# EAGLE design PikaCharge V2 (EAGLE 9.3.1)
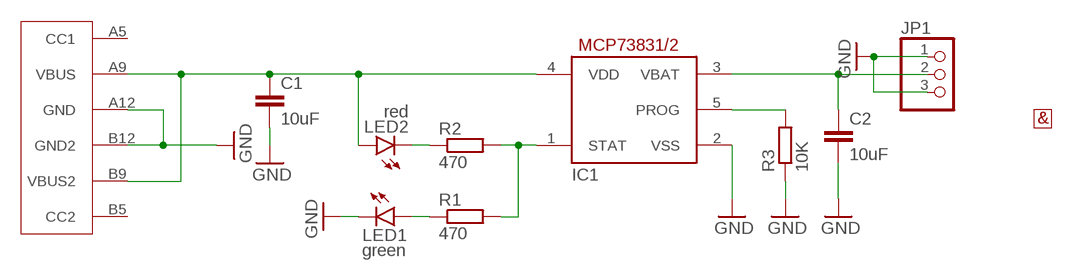
[diagram p0: schematic, sheet 1]

## Parts
C1  10uF  C-EUC0805  [C0805]
C2  10uF  C-EUC0805  [C0805]
IC1  MCP73831/OT  [SOT23-5L]
JP1  PINHD-1X03_2.54-S  [1X03-S]
LED1  green  LEDCHIP-LED0805  [CHIP-LED0805]
LED2  red  LEDCHIP-LED0805  [CHIP-LED0805]
R1  470  R-EU_R0805  [R0805]
R2  470  R-EU_R0805  [R0805]
R3  10K  R-EU_R0805  [R0805]
U$1  USB-C-6PIN  [USB-C-6PIN]
U$2  AMP-HALF  [AMP-HALF]

## Nets
GND: C1.2 C2.2 IC1.2(VSS) JP1.1 JP1.3 LED1.C R3.1 U$1.A12(GND) U$1.B12(GND2)
N$1: IC1.5(PROG) R3.2
N$2: IC1.1(STAT) R1.2 R2.2
N$3: LED2.C R2.1
N$4: LED1.A R1.1
N$5: C1.1 IC1.4(VDD) LED2.A U$1.A9(VBUS) U$1.B9(VBUS2)
N$6: C2.1 IC1.3(VBAT) JP1.2
Unconnected: U$1.A5(CC1) U$1.B5(CC2)

## Library data of the parts
C1 C2 = rcl:C-EU: CAPACITOR, European symbol; SPICEPREFIX: C
IC1 = adafruit:MCP73831: MCP73831/2 Miniature Single-Cell, Fully Integrated Li-Ion, Li-Polymer Charge Management Controllers. Nice and small simple lipoly charge controller, with adjustable current and status output (LED) http://www.ladyada.net/library/pcb/eaglelibrary.html
JP1 = ESPkachu:PINHD-1X03: PIN HEADER
LED1 LED2 = led:LED: LED OSRAM: - CHIPLED LG R971, LG N971, LY N971, LG Q971, LY Q971, LO R971, LY R971 LH N974, LH R974 LS Q976, LO Q976, LY Q976 LO Q996 - Hyper CHIPLED LW Q18S LB Q993, LB Q99A, LB R99A - SideLED LS A670, LO A670, LY A670, LG A670, LP A670 LB A673, LV A673, LT A673, LW A673 LH A674 LY A675 LS A676, LA A676, LO A676, LY A676, LW A676 LS A679, LY A679, LG A679 - Hyper Micro SIDELED® LS Y876, LA Y876, LO Y876, LY Y876 LT Y87S - SmartLED LW L88C, LW L88S LB L89C, LB L89S, LG L890 LS L89K, LO L89K, LY L89K LS L896, LA L896, LO L896, LY L896 - TOPLED LS T670, LO T670, LY T670, LG T670, LP T670 LSG T670, LSP T670, LSY T670, LOP T670, LYG T670 LG T671, LOG T671, LSG T671 LB T673, LV T673, LT T673, LW T673 LH T674 LS T676, LA T676, LO T676, LY T676, LB T676, LH T676, LSB T676, LW T676 LB T67C, LV T67C, LT T67C, LS T67K, LO T67K, LY T67K, LW E67C LS E67B, LA E67B, LO E67B, LY E67B, LB E67C, LV E67C, LT E67C LW T67C LS T679, LY T679, LG T679 LS T770, LO T770, LY T770, LG T770, LP T770 LB T773, LV T773, LT T773, LW T773 LH T774 LS E675, LA E675, LY E675, LS T675 LS T776, LA T776, LO T776, LY T776, LB T776 LHGB T686 LT T68C, LB T68C - Hyper Mini TOPLED® LB M676 - Mini TOPLED Santana® LG M470 LS M47K, LO M47K, LY M47K Source: http://www.osram.convergy.de LUXEON: - LUMILED® LXK2-PW12-R00, LXK2-PW12-S00, LXK2-PW14-U00, LXK2-PW14-V00 LXK2-PM12-R00, LXK2-PM12-S00, LXK2-PM14-U00 LXK2-PE12-Q00, LXK2-PE12-R00, LXK2-PE12-S00, LXK2-PE14-T00, LXK2-PE14-U00 LXK2-PB12-K00, LXK2-PB12-L00, LXK2-PB12-M00, LXK2-PB14-N00, LXK2-PB14-P00, LXK2-PB14-Q00 LXK2-PR12-L00, LXK2-PR12-M00, LXK2-PR14-Q00, LXK2-PR14-R00 LXK2-PD12-Q00, LXK2-PD12-R00, LXK2-PD12-S00 LXK2-PH12-R00, LXK2-PH12-S00 LXK2-PL12-P00, LXK2-PL12-Q00, LXK2-PL12-R00 Source: www.luxeon.com KINGBRIGHT: KA-3528ASYC Source: www.kingbright.com
R1-R3 = resistor:R-EU_: RESISTOR, European symbol
U$1 = ESPkachu:USB-C-6PIN
U$2 = ESPkachu:AMP-HALF

## Board
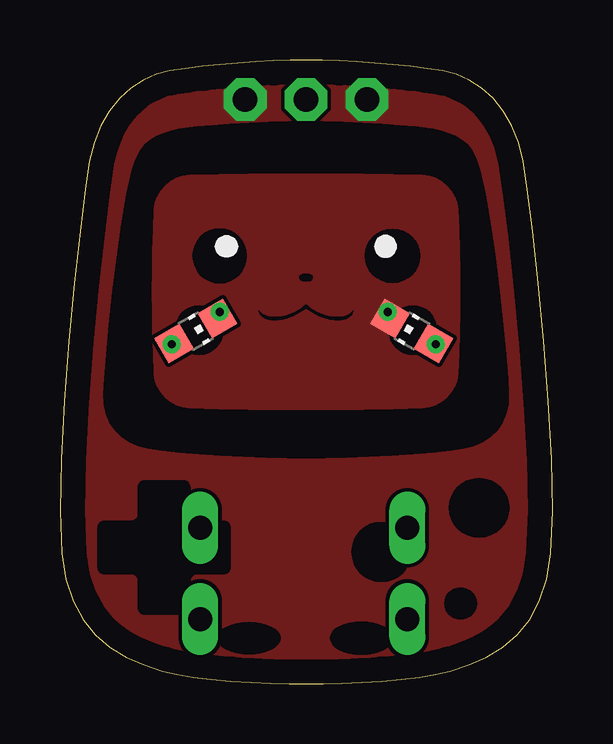
[diagram p1: board, top side]
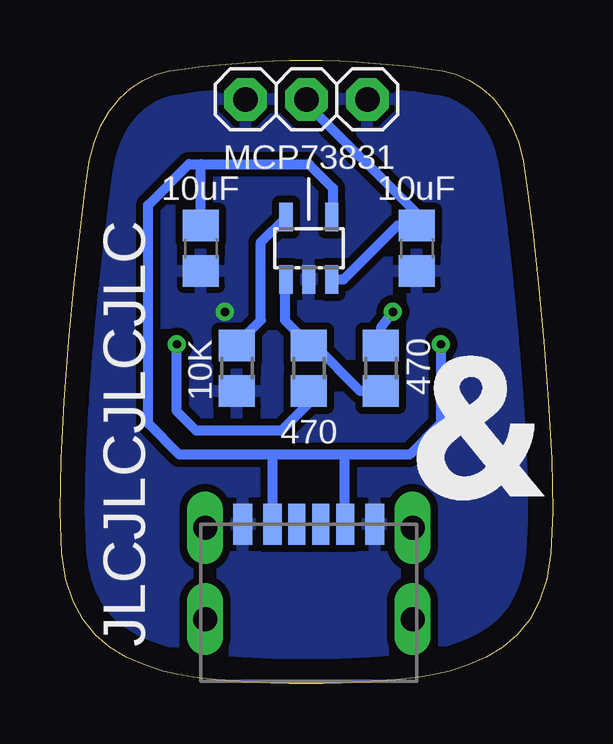
[diagram p2: board, bottom side, seen from below]

Size 20.53 x 26 mm. Coordinates in mm from the lower left corner, seen from the top.
Outline: 20.15,14.27 19.93,16.69 19.69,18.86 19.47,20.61 19.3,21.78 19.11,22.56 18.83,23.26 18.47,23.87 18.05,24.39 17.57,24.83 17.05,25.17 16.51,25.41 15.96,25.55 15.3,25.64 14.6,25.73 13.87,25.81 13.12,25.87 12.37,25.93 11.64,25.97 10.93,25.99 10.26,26 9.6,25.99 8.89,25.97 8.15,25.93 7.41,25.87 6.66,25.81 5.93,25.73 5.23,25.64 4.57,25.55 4.01,25.41 3.47,25.17 2.96,24.83 2.48,24.39 2.06,23.87 1.7,23.26 1.42,22.56 1.23,21.78 1.05,20.61 0.84,18.86 0.6,16.69 0.37,14.27 0.18,11.77 0.04,9.36 0,7.2 0.07,5.45 0.25,4.37 0.55,3.45 0.96,2.68 1.48,2.05 2.08,1.53 2.76,1.12 3.5,0.79 4.29,0.53 4.86,0.4 5.55,0.29 6.31,0.19 7.12,0.12 7.96,0.07 8.78,0.03 9.56,0.01 10.26,0 10.97,0.01 11.75,0.03 12.57,0.07 13.4,0.12 14.22,0.19 14.98,0.29 15.66,0.4 16.24,0.53 17.03,0.79 17.77,1.12 18.44,1.53 19.05,2.05 19.56,2.68 19.98,3.45 20.28,4.37 20.46,5.45 20.53,7.2 20.48,9.36 20.35,11.77 20.15,14.27
Copper layers (1*16): Top 0.035mm / dielectric 1.5mm / Bottom 0.035mm
Design rules "default": minimum track width 6mil, minimum drill 0.35mm, track to track 6mil, track to pad 6mil, pad to pad 6mil, via to via 6mil, smd to smd 6mil, copper to edge 40mil, drill to drill 6mil, minimum pad ring 10mil, minimum via ring 8mil, stop-mask expansion 4mil, vias tented up to drill 0mil, thermal gap 10mil
tRestrict: area 13.7,13.7 to 15.7,15.8; area 4.8,13.7 to 6.8,15.8; 592 lines

### Footprints (pad centres in the part's own frame; a part is rotated, then mirrored left to right if it is on the bottom)
C0805 = smd 1.3 x 1.5: 1 -0.95,0; 2 0.95,0
SOT23-5L = smd 0.55 x 1.2: 1 -0.95,-1.3; 2 0,-1.3; 3 0.95,-1.3; 4 0.95,1.3; 5 -0.95,1.3
1X03-S = drill 1.016 pad 1.778 octagon: 1 -2.54,0; 2 0,0; 3 2.54,0
CHIP-LED0805 = smd 1.2 x 1.2: A 0,-1.05; C 0,1.05
R0805 = smd 1.3 x 1.5: 1 -0.95,0; 2 0.95,0
USB-C-6PIN = smd 0.7 x 1.7: A5 -0.5,0; B5 0.5,0 | smd 0.76 x 1.7: A9 1.52,0; B9 -1.52,0 | smd 0.8 x 1.7: A12 2.75,0; B12 -2.75,0 | drill 1 pad 1.016 long: P$7 4.32,-0.15; P$8 -4.32,-0.15; P$9 4.32,-3.95; P$10 -4.32,-3.95

### Placement (x,y rotation side)
C1  14.66,18.16 270 bottom
C2  5.66,18.16 270 bottom
IC1  10.16,18.16 0 bottom
JP1  10.26,24.36 0 bottom
LED1  14.66,14.71 60 top
LED2  5.66,14.71 300 top
R1  10.16,13.16 90 bottom
R2  7.16,13.16 270 bottom
R3  13.16,13.16 90 bottom
U$1  10.16,6.66 0 bottom
U$2  5.66,7.66 0 bottom

### Tracks (layer width: path | path; a pad name or v marks a point on that pad's centre or on a via)
GND  (via drill 0.35)
  Top 0.406: v13.66,15.51 13.57,15.41 LED1.C
  pour Bottom (isolate 0.305): -7.34,-15.84 27.66,-15.84 27.66,29.16 -7.34,29.16
  pour Top (no thermals): -1.04,-1.04 -1.04,26.96 21.96,26.96 21.96,-1.04
N$1
  Bottom 0.406: R3.2 13.16,14.16 12.16,15.16 12.16,18.41 IC1.5
N$2
  Bottom 0.406: IC1.1 11.16,16.81 11.16,15.16 10.16,14.16 R1.2 9.91,14.11 8.01,12.21 R2.2
N$3  (via drill 0.35)
  Top 0.406: LED2.C arc90 6.66,15.32 v6.66,15.51
  Bottom 0.406: R2.1 7.16,14.84 v6.66,15.51
N$4  (via drill 0.35)
  Top 0.406: LED1.A 15.76,14.18 v15.66,14.16
  Bottom 0.406: R1.1 10.16,11.71 11.31,10.56 14.86,10.56 15.66,11.36 v15.66,14.16
N$5  (via drill 0.35)
  Top 0.406: LED2.A 4.86,14.36 v4.66,14.16
  Bottom 0.406: IC1.4 9.16,19.51 9.16,20.66 10.16,21.66 14.66,21.66 | v4.66,14.16 4.66,10.86 5.96,9.56 8.66,9.56 | 8.66,9.56 11.66,9.56 | 11.66,9.56 15.56,9.56 16.86,10.86 16.86,19.96 15.16,21.66 14.66,21.66 | C1.1 14.66,21.66 | U$1.A9 8.66,6.68 8.66,9.56 | U$1.B9 11.66,6.68 11.66,9.56
N$6
  Bottom 0.406: IC1.3 8.71,16.86 6.46,19.11 C2.1 5.66,19.61 10.26,24.21 JP1.2

### Text on the board
bPlace: MCP73831 | 10uF | 10uF | JLCJLCJLCJLC | 470 | 10K | 470